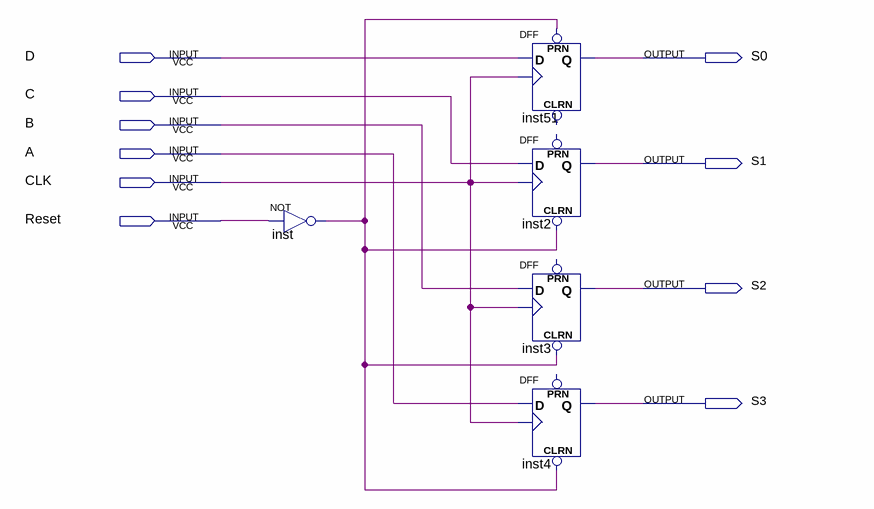
[diagram p0: schematic sheet]
// Quartus schematic Registrador.bdf as structural Verilog: 5 symbols, 10 pins
module Registrador (
  input  D,
  input  C,
  input  B,
  input  A,
  input  CLK,
  input  Reset,
  output S0,
  output S1,
  output S2,
  output S3
);

  wire inst_out;

  not inst (inst_out, Reset);
  DFF inst51 (.CLK(CLK), .D(D), .PRN(inst_out), .Q(S0));  // open: CLRN
  DFF inst2 (.CLRN(inst_out), .CLK(CLK), .D(C), .Q(S1));  // open: PRN
  DFF inst3 (.CLRN(inst_out), .CLK(CLK), .D(B), .Q(S2));  // open: PRN
  DFF inst4 (.CLRN(inst_out), .CLK(CLK), .D(A), .Q(S3));  // open: PRN
endmodule
